# Altium schematic sheet 50_Distance.SchDoc
size A3; SheetNumber: 6; SheetTotal: 11
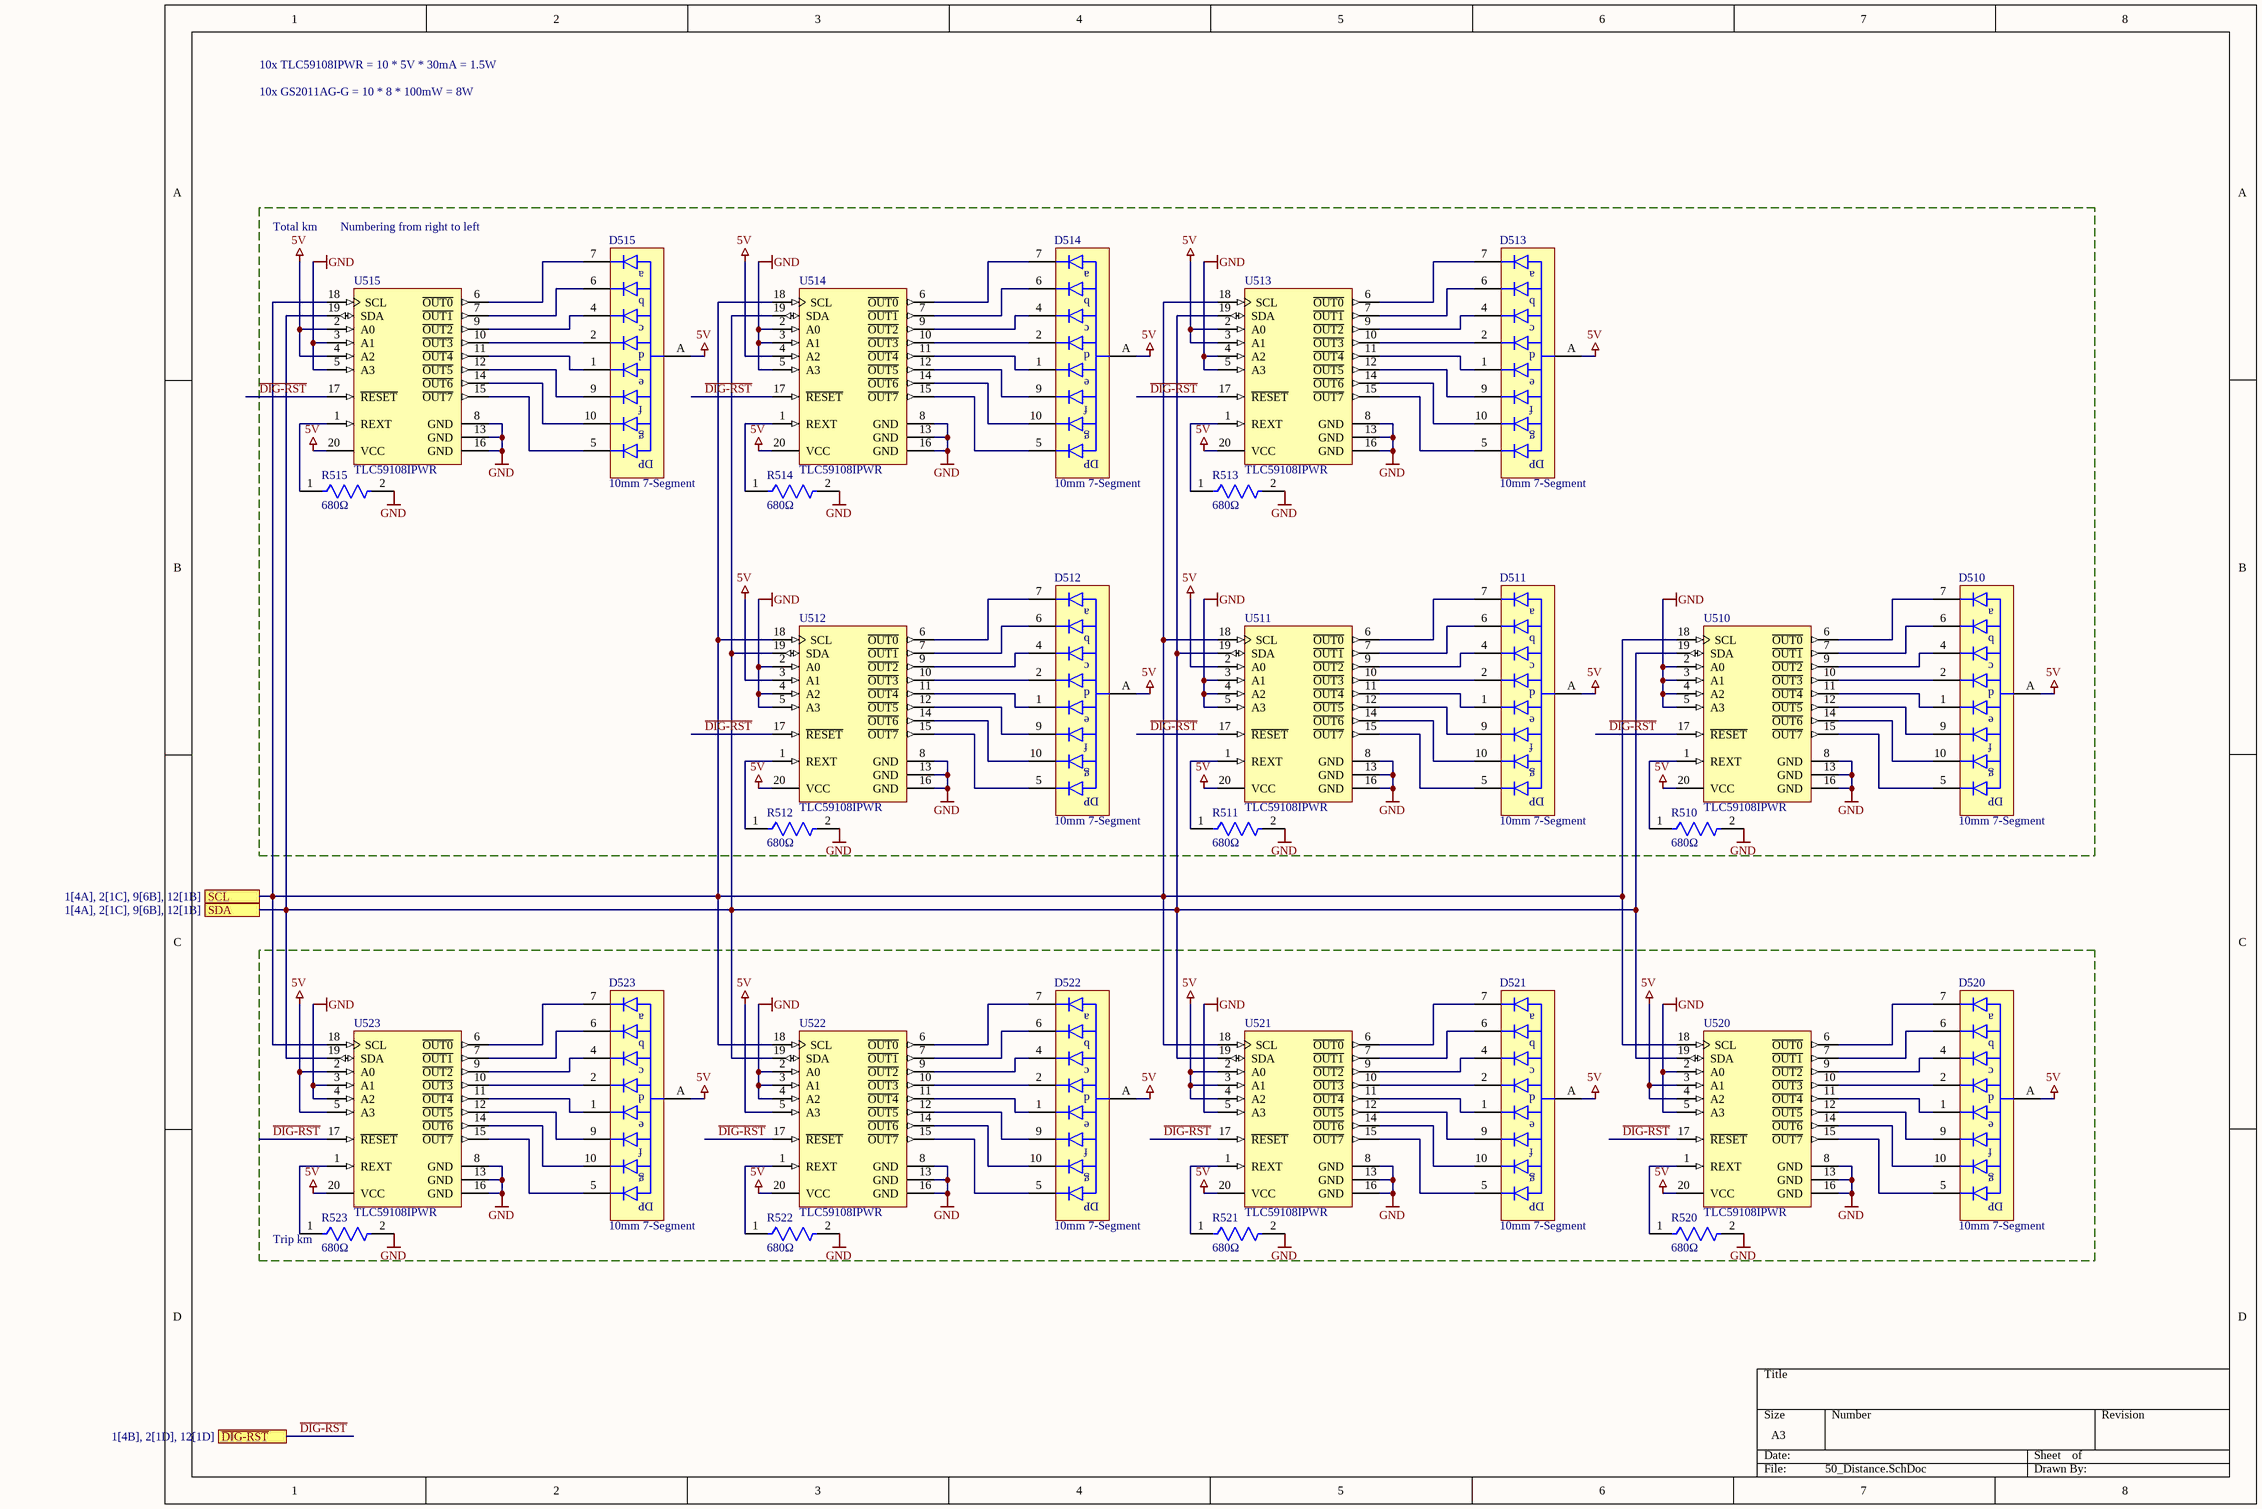
[diagram p0: 50_Distance.SchDoc]

## Parts
D510  10mm 7-Segment  [GS2011AG-G]
D511  10mm 7-Segment  [GS2011AG-G]
D512  10mm 7-Segment  [GS2011AG-G]
D513  10mm 7-Segment  [GS2011AG-G]
D514  10mm 7-Segment  [GS2011AG-G]
D515  10mm 7-Segment  [GS2011AG-G]
D520  10mm 7-Segment  [GS2011AG-G]
D521  10mm 7-Segment  [GS2011AG-G]
D522  10mm 7-Segment  [GS2011AG-G]
D523  10mm 7-Segment  [GS2011AG-G]
R510  680Ω  [FP-CRCW0603-e3-IPC_A]
R511  680Ω  [FP-CRCW0603-e3-IPC_A]
R512  680Ω  [FP-CRCW0603-e3-IPC_A]
R513  680Ω  [FP-CRCW0603-e3-IPC_A]
R514  680Ω  [FP-CRCW0603-e3-IPC_A]
R515  680Ω  [FP-CRCW0603-e3-IPC_A]
R520  680Ω  [FP-CRCW0603-e3-IPC_A]
R521  680Ω  [FP-CRCW0603-e3-IPC_A]
R522  680Ω  [FP-CRCW0603-e3-IPC_A]
R523  680Ω  [FP-CRCW0603-e3-IPC_A]
U510  TLC59108IPWR  [PW0020A_M]
U511  TLC59108IPWR  [PW0020A_M]
U512  TLC59108IPWR  [PW0020A_M]
U513  TLC59108IPWR  [PW0020A_M]
U514  TLC59108IPWR  [PW0020A_M]
U515  TLC59108IPWR  [PW0020A_M]
U520  TLC59108IPWR  [PW0020A_M]
U521  TLC59108IPWR  [PW0020A_M]
U522  TLC59108IPWR  [PW0020A_M]
U523  TLC59108IPWR  [PW0020A_M]

## Blocks framed on the sheet
Trip km: D520-D523 R520-R523 U520-U523

## Ports
SCL (see 1[4A], 2[1C], 9[6B], 12[1B]), SDA (see 1[4A], 2[1C], 9[6B], 12[1B]), ~{DIG-RST} (see 1[4B], 2[1D], 12[1D])

## Nets
5V: D510.A D511.A D512.A D513.A D514.A D515.A D520.A D521.A D522.A D523.A U510.20(VCC) U511.2(A0) U511.20(VCC) U512.3(A1) U512.20(VCC) U513.2(A0) U513.3(A1) U513.20(VCC) U514.4(A2) U514.20(VCC) U515.2(A0) U515.4(A2) U515.20(VCC) U520.3(A1) U520.4(A2) U520.20(VCC) U521.2(A0) U521.3(A1) U521.4(A2) U521.20(VCC) U522.5(A3) U522.20(VCC) U523.2(A0) U523.5(A3) U523.20(VCC)
GND: R510.2 R511.2 R512.2 R513.2 R514.2 R515.2 R520.2 R521.2 R522.2 R523.2 U510.2(A0) U510.3(A1) U510.4(A2) U510.5(A3) U510.8(GND) U510.13(GND) U510.16(GND) U511.3(A1) U511.4(A2) U511.5(A3) U511.8(GND) U511.13(GND) U511.16(GND) U512.2(A0) U512.4(A2) U512.5(A3) U512.8(GND) U512.13(GND) U512.16(GND) U513.4(A2) U513.5(A3) U513.8(GND) U513.13(GND) U513.16(GND) U514.2(A0) U514.3(A1) U514.5(A3) U514.8(GND) U514.13(GND) U514.16(GND) U515.3(A1) U515.5(A3) U515.8(GND) U515.13(GND) U515.16(GND) U520.2(A0) U520.5(A3) U520.8(GND) U520.13(GND) U520.16(GND) U521.5(A3) U521.8(GND) U521.13(GND) U521.16(GND) U522.2(A0) U522.3(A1) U522.4(A2) U522.8(GND) U522.13(GND) U522.16(GND) U523.3(A1) U523.4(A2) U523.8(GND) U523.13(GND) U523.16(GND)
~{DIG-RST}: U510.17(~{RESET}) U511.17(~{RESET}) U512.17(~{RESET}) U513.17(~{RESET}) U514.17(~{RESET}) U515.17(~{RESET}) U520.17(~{RESET}) U521.17(~{RESET}) U522.17(~{RESET}) U523.17(~{RESET}) ; port ~{DIG-RST}
SCL: U510.18(SCL) U511.18(SCL) U512.18(SCL) U513.18(SCL) U514.18(SCL) U515.18(SCL) U520.18(SCL) U521.18(SCL) U522.18(SCL) U523.18(SCL) ; port SCL
SDA: U510.19(SDA) U511.19(SDA) U512.19(SDA) U513.19(SDA) U514.19(SDA) U515.19(SDA) U520.19(SDA) U521.19(SDA) U522.19(SDA) U523.19(SDA) ; port SDA
NetD510_1: D510.1 U510.11(~{OUT4})
NetD510_2: D510.2 U510.10(~{OUT3})
NetD510_4: D510.4 U510.9(~{OUT2})
NetD510_5: D510.5 U510.15(~{OUT7})
NetD510_6: D510.6 U510.7(~{OUT1})
NetD510_7: D510.7 U510.6(~{OUT0})
NetD510_9: D510.9 U510.12(~{OUT5})
NetD510_10: D510.10 U510.14(~{OUT6})
NetD511_1: D511.1 U511.11(~{OUT4})
NetD511_2: D511.2 U511.10(~{OUT3})
NetD511_4: D511.4 U511.9(~{OUT2})
NetD511_5: D511.5 U511.15(~{OUT7})
NetD511_6: D511.6 U511.7(~{OUT1})
NetD511_7: D511.7 U511.6(~{OUT0})
NetD511_9: D511.9 U511.12(~{OUT5})
NetD511_10: D511.10 U511.14(~{OUT6})
NetD512_1: D512.1 U512.11(~{OUT4})
NetD512_2: D512.2 U512.10(~{OUT3})
NetD512_4: D512.4 U512.9(~{OUT2})
NetD512_5: D512.5 U512.15(~{OUT7})
NetD512_6: D512.6 U512.7(~{OUT1})
NetD512_7: D512.7 U512.6(~{OUT0})
NetD512_9: D512.9 U512.12(~{OUT5})
NetD512_10: D512.10 U512.14(~{OUT6})
NetD513_1: D513.1 U513.11(~{OUT4})
NetD513_2: D513.2 U513.10(~{OUT3})
NetD513_4: D513.4 U513.9(~{OUT2})
NetD513_5: D513.5 U513.15(~{OUT7})
NetD513_6: D513.6 U513.7(~{OUT1})
NetD513_7: D513.7 U513.6(~{OUT0})
NetD513_9: D513.9 U513.12(~{OUT5})
NetD513_10: D513.10 U513.14(~{OUT6})
NetD514_1: D514.1 U514.11(~{OUT4})
NetD514_2: D514.2 U514.10(~{OUT3})
NetD514_4: D514.4 U514.9(~{OUT2})
NetD514_5: D514.5 U514.15(~{OUT7})
NetD514_6: D514.6 U514.7(~{OUT1})
NetD514_7: D514.7 U514.6(~{OUT0})
NetD514_9: D514.9 U514.12(~{OUT5})
NetD514_10: D514.10 U514.14(~{OUT6})
NetD515_1: D515.1 U515.11(~{OUT4})
NetD515_2: D515.2 U515.10(~{OUT3})
NetD515_4: D515.4 U515.9(~{OUT2})
NetD515_5: D515.5 U515.15(~{OUT7})
NetD515_6: D515.6 U515.7(~{OUT1})
NetD515_7: D515.7 U515.6(~{OUT0})
NetD515_9: D515.9 U515.12(~{OUT5})
NetD515_10: D515.10 U515.14(~{OUT6})
NetD520_1: D520.1 U520.11(~{OUT4})
NetD520_2: D520.2 U520.10(~{OUT3})
NetD520_4: D520.4 U520.9(~{OUT2})
NetD520_5: D520.5 U520.15(~{OUT7})
NetD520_6: D520.6 U520.7(~{OUT1})
NetD520_7: D520.7 U520.6(~{OUT0})
NetD520_9: D520.9 U520.12(~{OUT5})
NetD520_10: D520.10 U520.14(~{OUT6})
NetD521_1: D521.1 U521.11(~{OUT4})
NetD521_2: D521.2 U521.10(~{OUT3})
NetD521_4: D521.4 U521.9(~{OUT2})
NetD521_5: D521.5 U521.15(~{OUT7})
NetD521_6: D521.6 U521.7(~{OUT1})
NetD521_7: D521.7 U521.6(~{OUT0})
NetD521_9: D521.9 U521.12(~{OUT5})
NetD521_10: D521.10 U521.14(~{OUT6})
NetD522_1: D522.1 U522.11(~{OUT4})
NetD522_2: D522.2 U522.10(~{OUT3})
NetD522_4: D522.4 U522.9(~{OUT2})
NetD522_5: D522.5 U522.15(~{OUT7})
NetD522_6: D522.6 U522.7(~{OUT1})
NetD522_7: D522.7 U522.6(~{OUT0})
NetD522_9: D522.9 U522.12(~{OUT5})
NetD522_10: D522.10 U522.14(~{OUT6})
NetD523_1: D523.1 U523.11(~{OUT4})
NetD523_2: D523.2 U523.10(~{OUT3})
NetD523_4: D523.4 U523.9(~{OUT2})
NetD523_5: D523.5 U523.15(~{OUT7})
NetD523_6: D523.6 U523.7(~{OUT1})
NetD523_7: D523.7 U523.6(~{OUT0})
NetD523_9: D523.9 U523.12(~{OUT5})
NetD523_10: D523.10 U523.14(~{OUT6})
NetR510_1: R510.1 U510.1(REXT)
NetR511_1: R511.1 U511.1(REXT)
NetR512_1: R512.1 U512.1(REXT)
NetR513_1: R513.1 U513.1(REXT)
NetR514_1: R514.1 U514.1(REXT)
NetR515_1: R515.1 U515.1(REXT)
NetR520_1: R520.1 U520.1(REXT)
NetR521_1: R521.1 U521.1(REXT)
NetR522_1: R522.1 U522.1(REXT)
NetR523_1: R523.1 U523.1(REXT)

## Notes on the sheet
- 10x TLC59108IPWR = 10 * 5V * 30mA = 1.5W
- 10x GS2011AG-G = 10 * 8 * 100mW = 8W
- Total km
- Numbering from right to left
- (in symbol GS2011AG-G) a; b; c; d; e; f; g; DP

## Library data of the parts
D510-D515 D520-D523 = GS2011AG-G: SMD, 10x6.9mm 7-Segment
R510-R515 R520-R523 = CMP-2000-03530-2: RES Thick Film, 680Ω, 5%, 0.1W, 200ppm/°C, 0603 / CRCW0603680RJNEA; Power Rating: 100mW; Voltage Rating: 75V; Resistance: 680R; Max Operating Temperature: 155°C; Package Quantity: 1; Features: Automotive AEC-Q200; Composition: Thick Film; Length: 1.55mm; Voltage Rating (DC): 75V; Number of Terminations: 2; Termination: SMD/SMT; Case/Package: 0603; Height: 0.45mm; Min Operating Temperature: -55°C; Case Code (Imperial): 0603; Width: 0.033inch; Military Standard: Not; Max Power Dissipation: 100mW; Lead Free: Lead Free; Weight: 7.1E-05oz; Temperature Coefficient: 200ppm/°C; Contact Plating: Tin; Packaging: Tape and Reel; Radiation Hardening: No; Working Voltage: 75V; Tolerance: 5%; Number of Pins: 2; Depth: 0.85mm; Case Code (Metric): 1608
U510-U515 U520-U523 = CMP-0388-00397-2: 8-Bit Fast Mode Plus (FM+) I2C Bus Constant-Current LED Sink Driver, 3 to 5.5 V, -40 to 85 degC, 20-pin SOP (PW20), Green (RoHS & no Sb/Br); Manufacturer: Texas Instruments; Vin(Max)(V): 5.5; Vin(Min)(V): 3; Iout(Max)(A): 0.12; SubFamily: LED Driver; ComponentLink3URL: http://www.ti.com.cn/cn/lit/ml/mpds362/mpds362.pdf; PackageVersion: 4040064-5/G; ComponentLink1URL: http://www.ti.com/; ComponentLink2Description: Datasheet; ComponentLink2URL: http://www.ti.com/general/docs/lit/getliterature.tsp?genericPartNumber=TLC59108&fileType=pdf; PackageReference: PW0020A; PackageDescription: 20-Pin Plastic Small Outline, Body 6.5 x 4.4 mm, 0.65 mm Pitch; ComponentLink1Description: Manufacturer URL; ComponentLink3Description: Package Specification; Eco-Plan: Green (RoHS & no Sb/Br); PartNumber: TLC59108IPWR; Code_JEDEC: MO-153; DatasheetVersion: SLDS156A; Mounting Technology: Surface Mount